# EasyEDA Pro project tumkibot_new.eprj

# Schematic Schematic1
Board Name: Board1; Create Date: 2025-09-24; Page Name: P1; Project Name: tumkibot_new; Schematic Name: Schematic1; Update Date: 2025-09-24; Company: EasyEDA.com; Page Size: A4; Version: V1.0
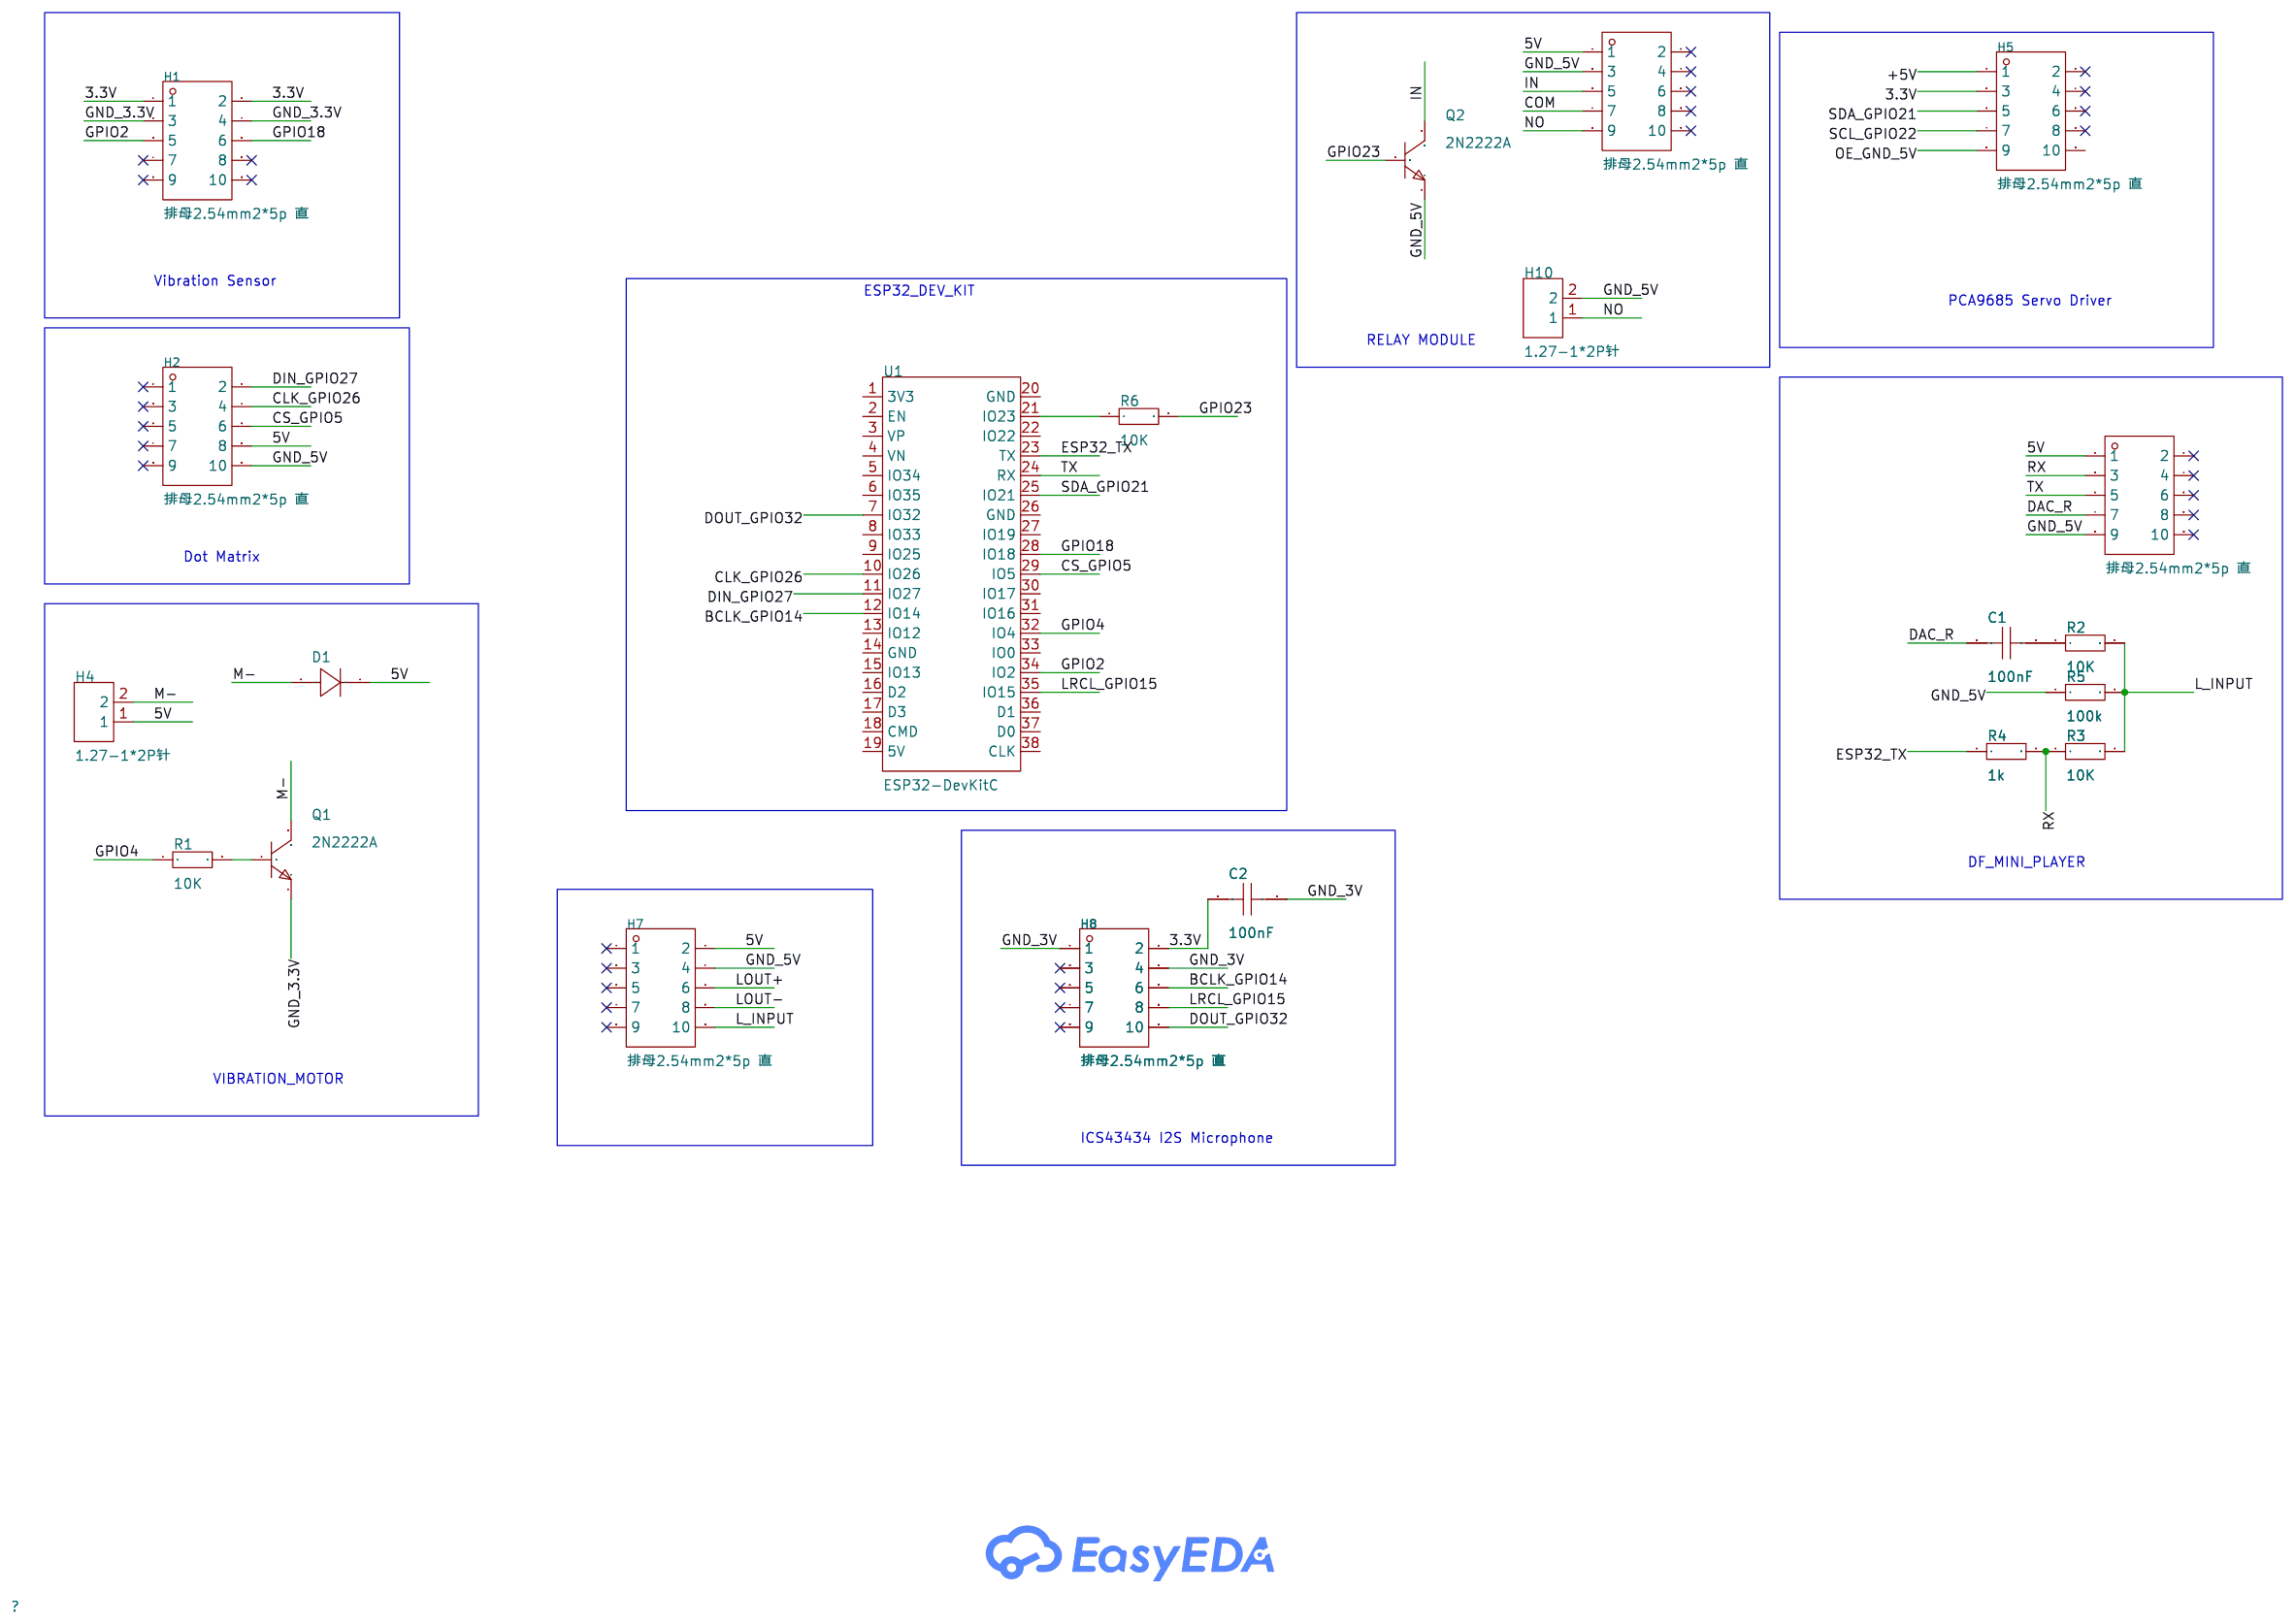
[diagram p0: schematic sheet]

## Parts
C1  100nF  [C0603]
C2  100nF  [C0603]
D1  -  [SMA_L4.4-W2.8-LS5.4-RD]
H1  排母2.54mm2*5p 直  [HDR-TH_10P-P2.54-V-F-R2-C5-S2.54]
H2  排母2.54mm2*5p 直  [HDR-TH_10P-P2.54-V-F-R2-C5-S2.54]
H4  1.27-1*2P针  [HDR-TH_2P-P1.27-V-M]
H5  排母2.54mm2*5p 直  [HDR-TH_10P-P2.54-V-F-R2-C5-S2.54]
H6  排母2.54mm2*5p 直  [HDR-TH_10P-P2.54-V-F-R2-C5-S2.54]
H7  排母2.54mm2*5p 直  [HDR-TH_10P-P2.54-V-F-R2-C5-S2.54]
H8  排母2.54mm2*5p 直  [HDR-TH_10P-P2.54-V-F-R2-C5-S2.54]
H9  排母2.54mm2*5p 直  [HDR-TH_10P-P2.54-V-F-R2-C5-S2.54]
H10  1.27-1*2P针  [HDR-TH_2P-P1.27-V-M]
Q1  2N2222A  [TO-92-3_L4.5-W3.5-P1.27-L]
Q2  2N2222A  [TO-92-3_L4.5-W3.5-P1.27-L]
R1  10K  [R0603]
R2  10K  [R0603]
R3  10K  [R0603]
R4  10K  [R0603]
R5  10K  [R0603]
R6  10K  [R0603]
U1  ESP32-DevKitC  [BULETM-SMD_ESP32-DEVKITC]

## Library data of the parts
C1 C2 = CAP_0603: Supplier Footprint: 0603
D1 = 1N4007: Supplier Footprint: SMA(DO-214AC); Supplier Part: C727081
H1 H2 H5-H9 = 排母2.54mm2*5p 直: LCSC Part Name: 间距:2.54mm 直插; Supplier Part: C30419; Manufacturer: BOOMELE(博穆精密); Supplier Footprint: 插件,P=2.54mm; JLCPCB Part Class: Extended Part; Supplier: LCSC; Pitch: 2.54mm; Row Spacing: 2.54mm; Mounting Type: Through Hole; Number of Rows: 2; Number of Positions: 10P; Contact Material: Brass
H4 H10 = 1.27-1*2P针: LCSC Part Name: 1x2P 间距:1.27mm 方针 直插; Supplier Part: C703015; Manufacturer: BOOMELE(博穆精密); Supplier Footprint: 插件,P=1.27mm; JLCPCB Part Class: Extended Part; Datasheet: https://item.szlcsc.com/datasheet/1.27-1*2P%25E9%2592%2588/738187.html; Supplier: LCSC; Pin Structure: 1x2P; Pitch: 1.27mm; Circluar Pins/Square Pins: Pin Header; Mounting Type: Through Hole; Number of Rows: 1; Number of Pins: 2P; Current Rating: 3A; Length of Mating Pin: 3mm; Insulation Height: 1.7mm; Length of End Connection Pin: 2.5mm; Contact Material: Brass; Operating Temperature: -55℃~+105℃; Color: Black
Q1 Q2 = 2N2222A_C20616319: Supplier Part: C20616319; Manufacturer: HXY MOSFET(华轩阳电子); Supplier Footprint: TO-92; JLCPCB Part Class: Extended Part; Datasheet: https://item.szlcsc.com/datasheet/2N2222A/21982678.html; Supplier: LCSC; type: NPN; Current - Collector(Ic): 600mA; Collector - Emitter Voltage VCEO: 40V; Pd - Power Dissipation: 625mW; DC Current Gain: 300@150mA,10V; Transition frequency(fT): 300MHz; Current - Collector Cutoff: 10nA; Vce Saturation(VCE(sat)): 600mV@500mA,50mA; Operating Temperature: -55℃~+150℃; Emitter-Base Voltage(Vebo): 6V; Number: 1 NPN
R1-R6 = Res_0603: Supplier Footprint: 0603
U1 = ESP32-DevKitC: LCSC Part Name: 开发板; Supplier Part: C571180; Manufacturer: ESPRESSIF(乐鑫); JLCPCB Part Class: Extended Part; Datasheet: https://atta.szlcsc.com/upload/public/pdf/source/20200521/C529586_D6FCDAFCFF160B3EDDF7DF28D600699D.pdf; Supplier: LCSC

## Nets
3.3V: C2.2 H1.1 H1.2 H5.3 H8.2
5V: D1.1(K) H2.8 H4.1 H6.1 H7.2 H9.1
+5V: H5.1
GND_3.3V: H1.3 H1.4 Q1.1(E)
GND_3V: C2.1 H8.1 H8.4
GND_5V: H2.10 H6.9 H7.4 H9.3 H10.2 Q2.1(E) R5.1
BCLK_GPIO14: H8.6 U1.12(IO14)
CLK_GPIO26: H2.4 U1.10(IO26)
COM: H9.7
CS_GPIO5: H2.6 U1.29(IO5)
DAC_R: C1.2 H6.7
DIN_GPIO27: H2.2 U1.11(IO27)
DOUT_GPIO32: H8.10 U1.7(IO32)
ESP32_TX: R4.1 U1.23(TX)
GPIO2: H1.5 U1.34(IO2)
GPIO4: R1.1 U1.32(IO4)
GPIO18: H1.6 U1.28(IO18)
GPIO23: Q2.2(B) R6.2
IN: H9.5 Q2.3(C)
L_INPUT: H7.10 R2.2 R3.2 R5.2
LOUT+: H7.6
LOUT-: H7.8
LRCL_GPIO15: H8.8 U1.35(IO15)
M-: D1.2(A) H4.2 Q1.3(C)
NO: H9.9 H10.1
OE_GND_5V: H5.9
RX: H6.3 R3.1 R4.2
SCL_GPIO22: H5.7
SDA_GPIO21: H5.5 U1.25(IO21)
TX: H6.5 U1.24(RX)
$1N2269: Q1.2(B) R1.2
$1N3379: C1.1 R2.1
$1N4010: R6.1 U1.21(IO23)

Not connected (* = marked no-connect by the designer): H1 7* 8* 9* 10*; H2 1* 3* 5* 7* 9*; H5 2* 4* 6* 8* 10; H6 2* 4* 6* 8* 10*; H7 1* 3* 5* 7* 9*; H8 3* 5* 7* 9*; H9 2* 4* 6* 8* 10*; U1 1(3V3) 2(EN) 3(VP) 4(VN) 5(IO34) 6(IO35) 8(IO33) 9(IO25) 13(IO12) 14(GND) 15(IO13) 16(D2) 17(D3) 18(CMD) 19(5V) 20(GND) 22(IO22) 26(GND) 27(IO19) 30(IO17) 31(IO16) 33(IO0) 36(D1) 37(D0) 38(CLK)

## Notes on the sheet
- Vibration Sensor
- ESP32_DEV_KIT
- PCA9685 Servo Driver
- RELAY MODULE
- Dot Matrix
- DF_MINI_PLAYER
- VIBRATION_MOTOR
- ICS43434 I2S Microphone

# Board PCB1
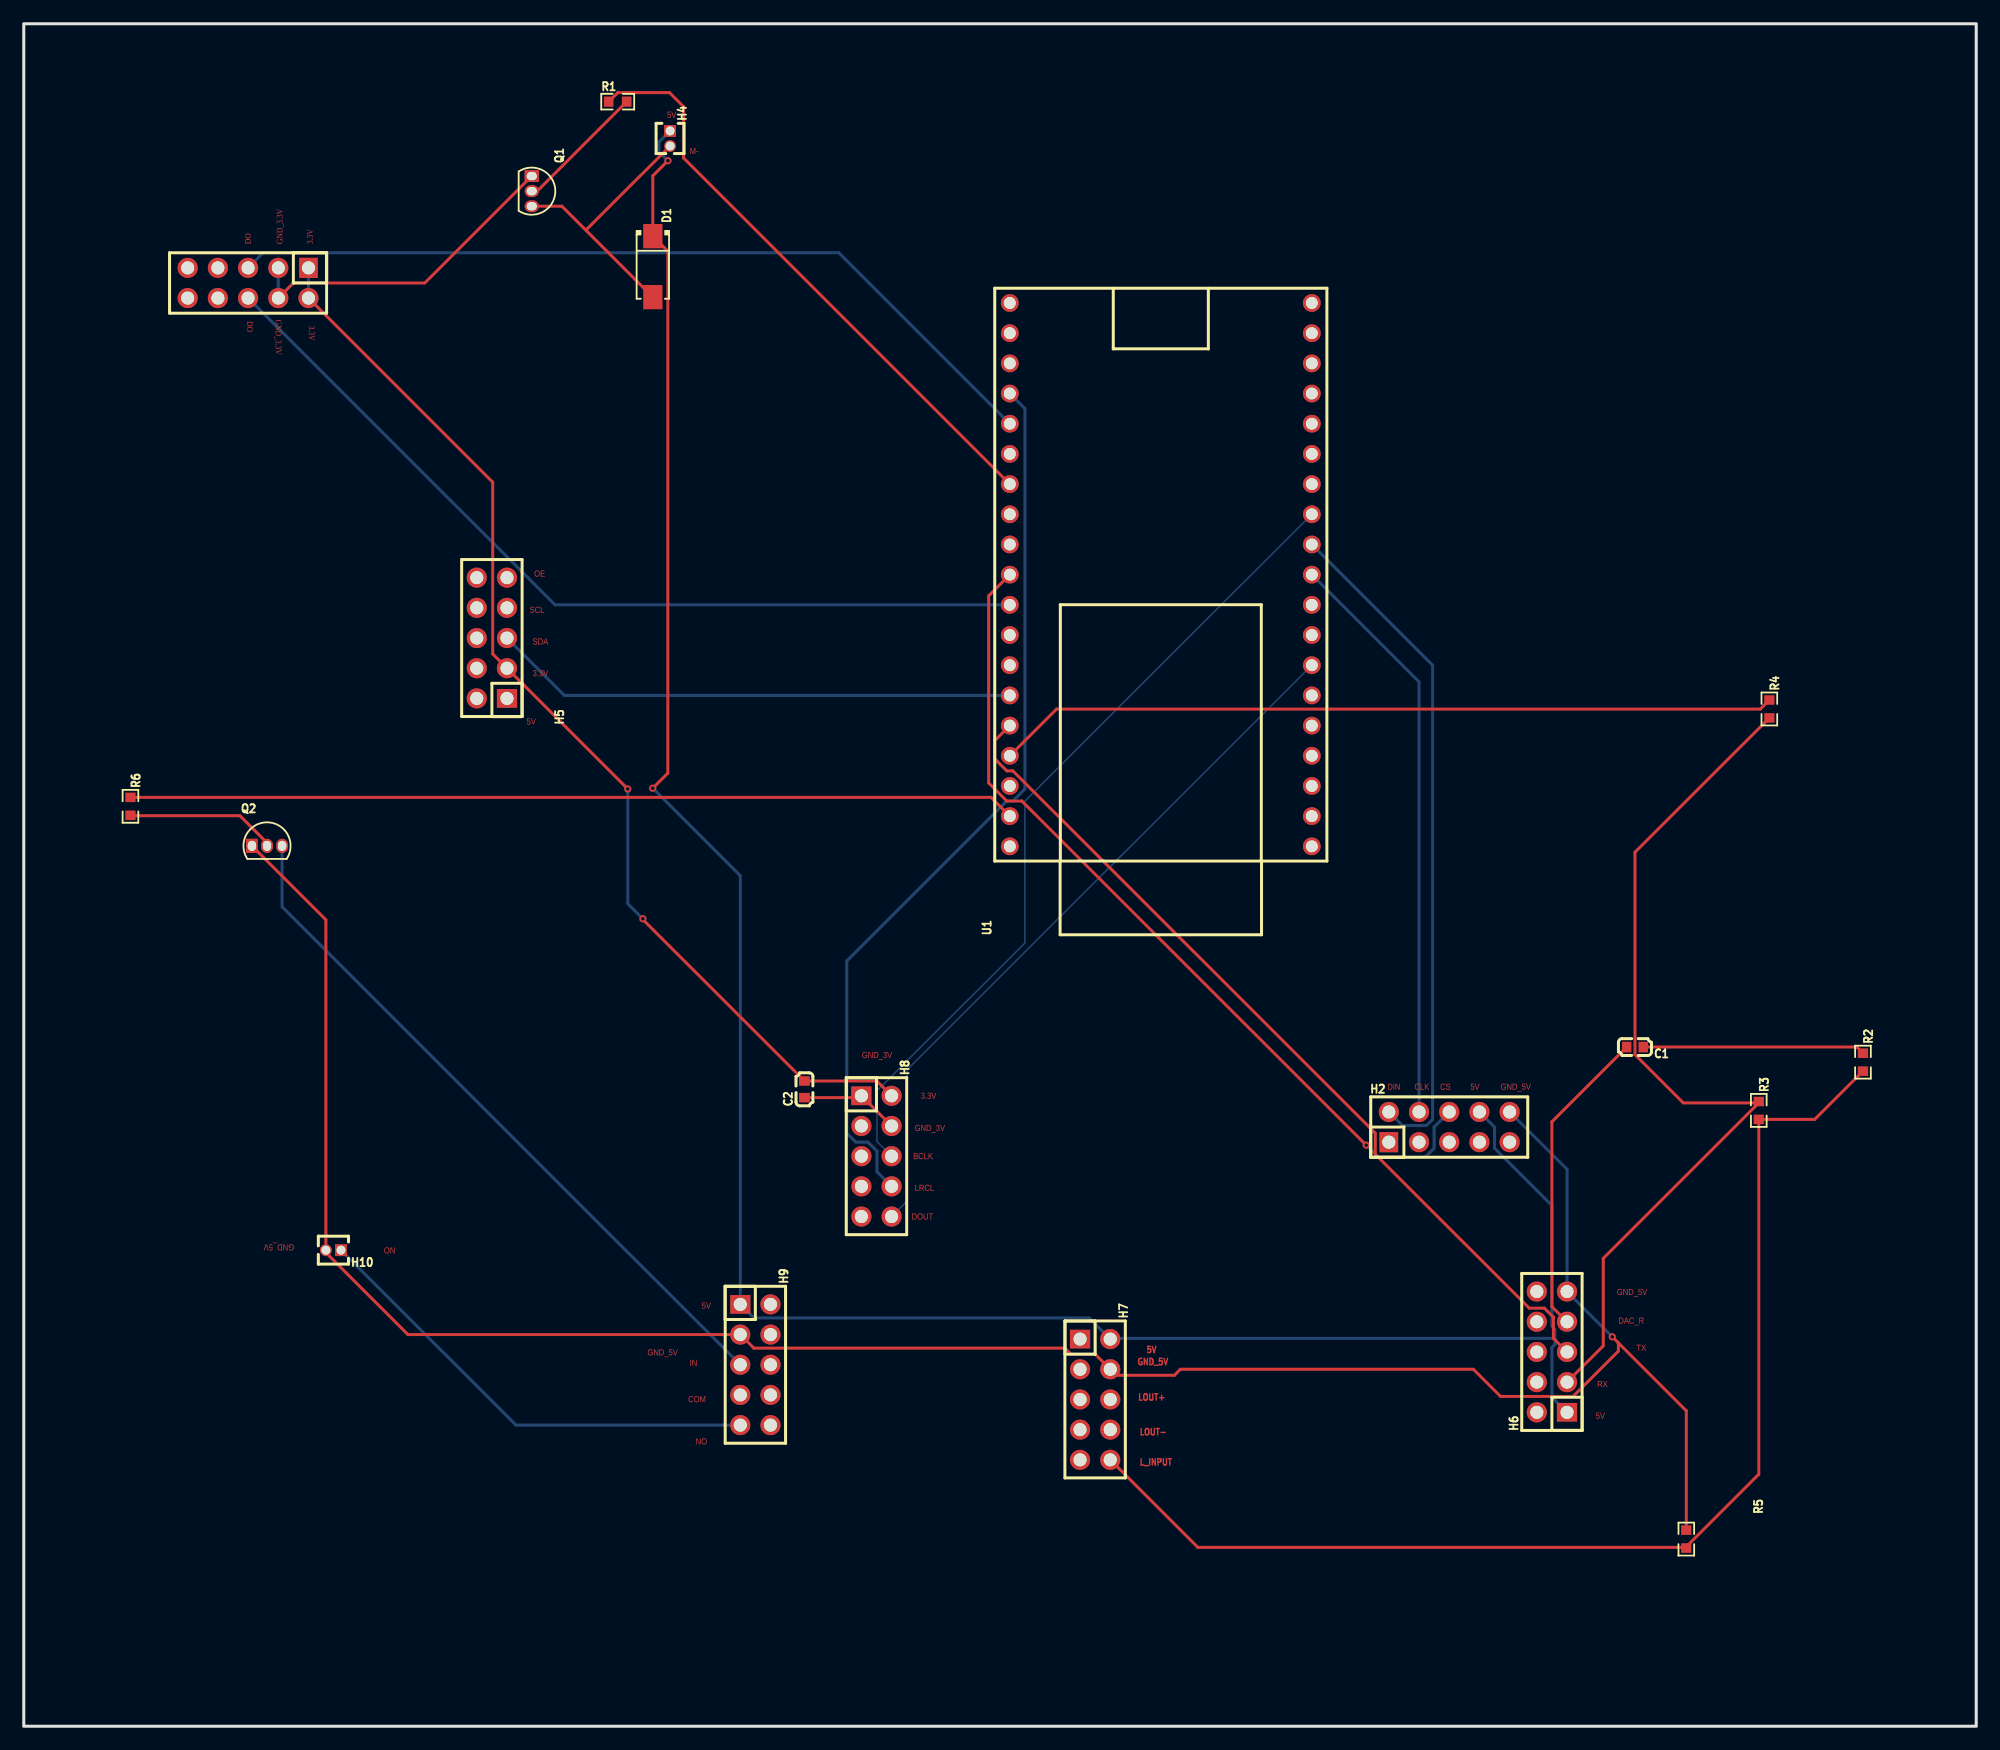
[diagram p1: board, top side]
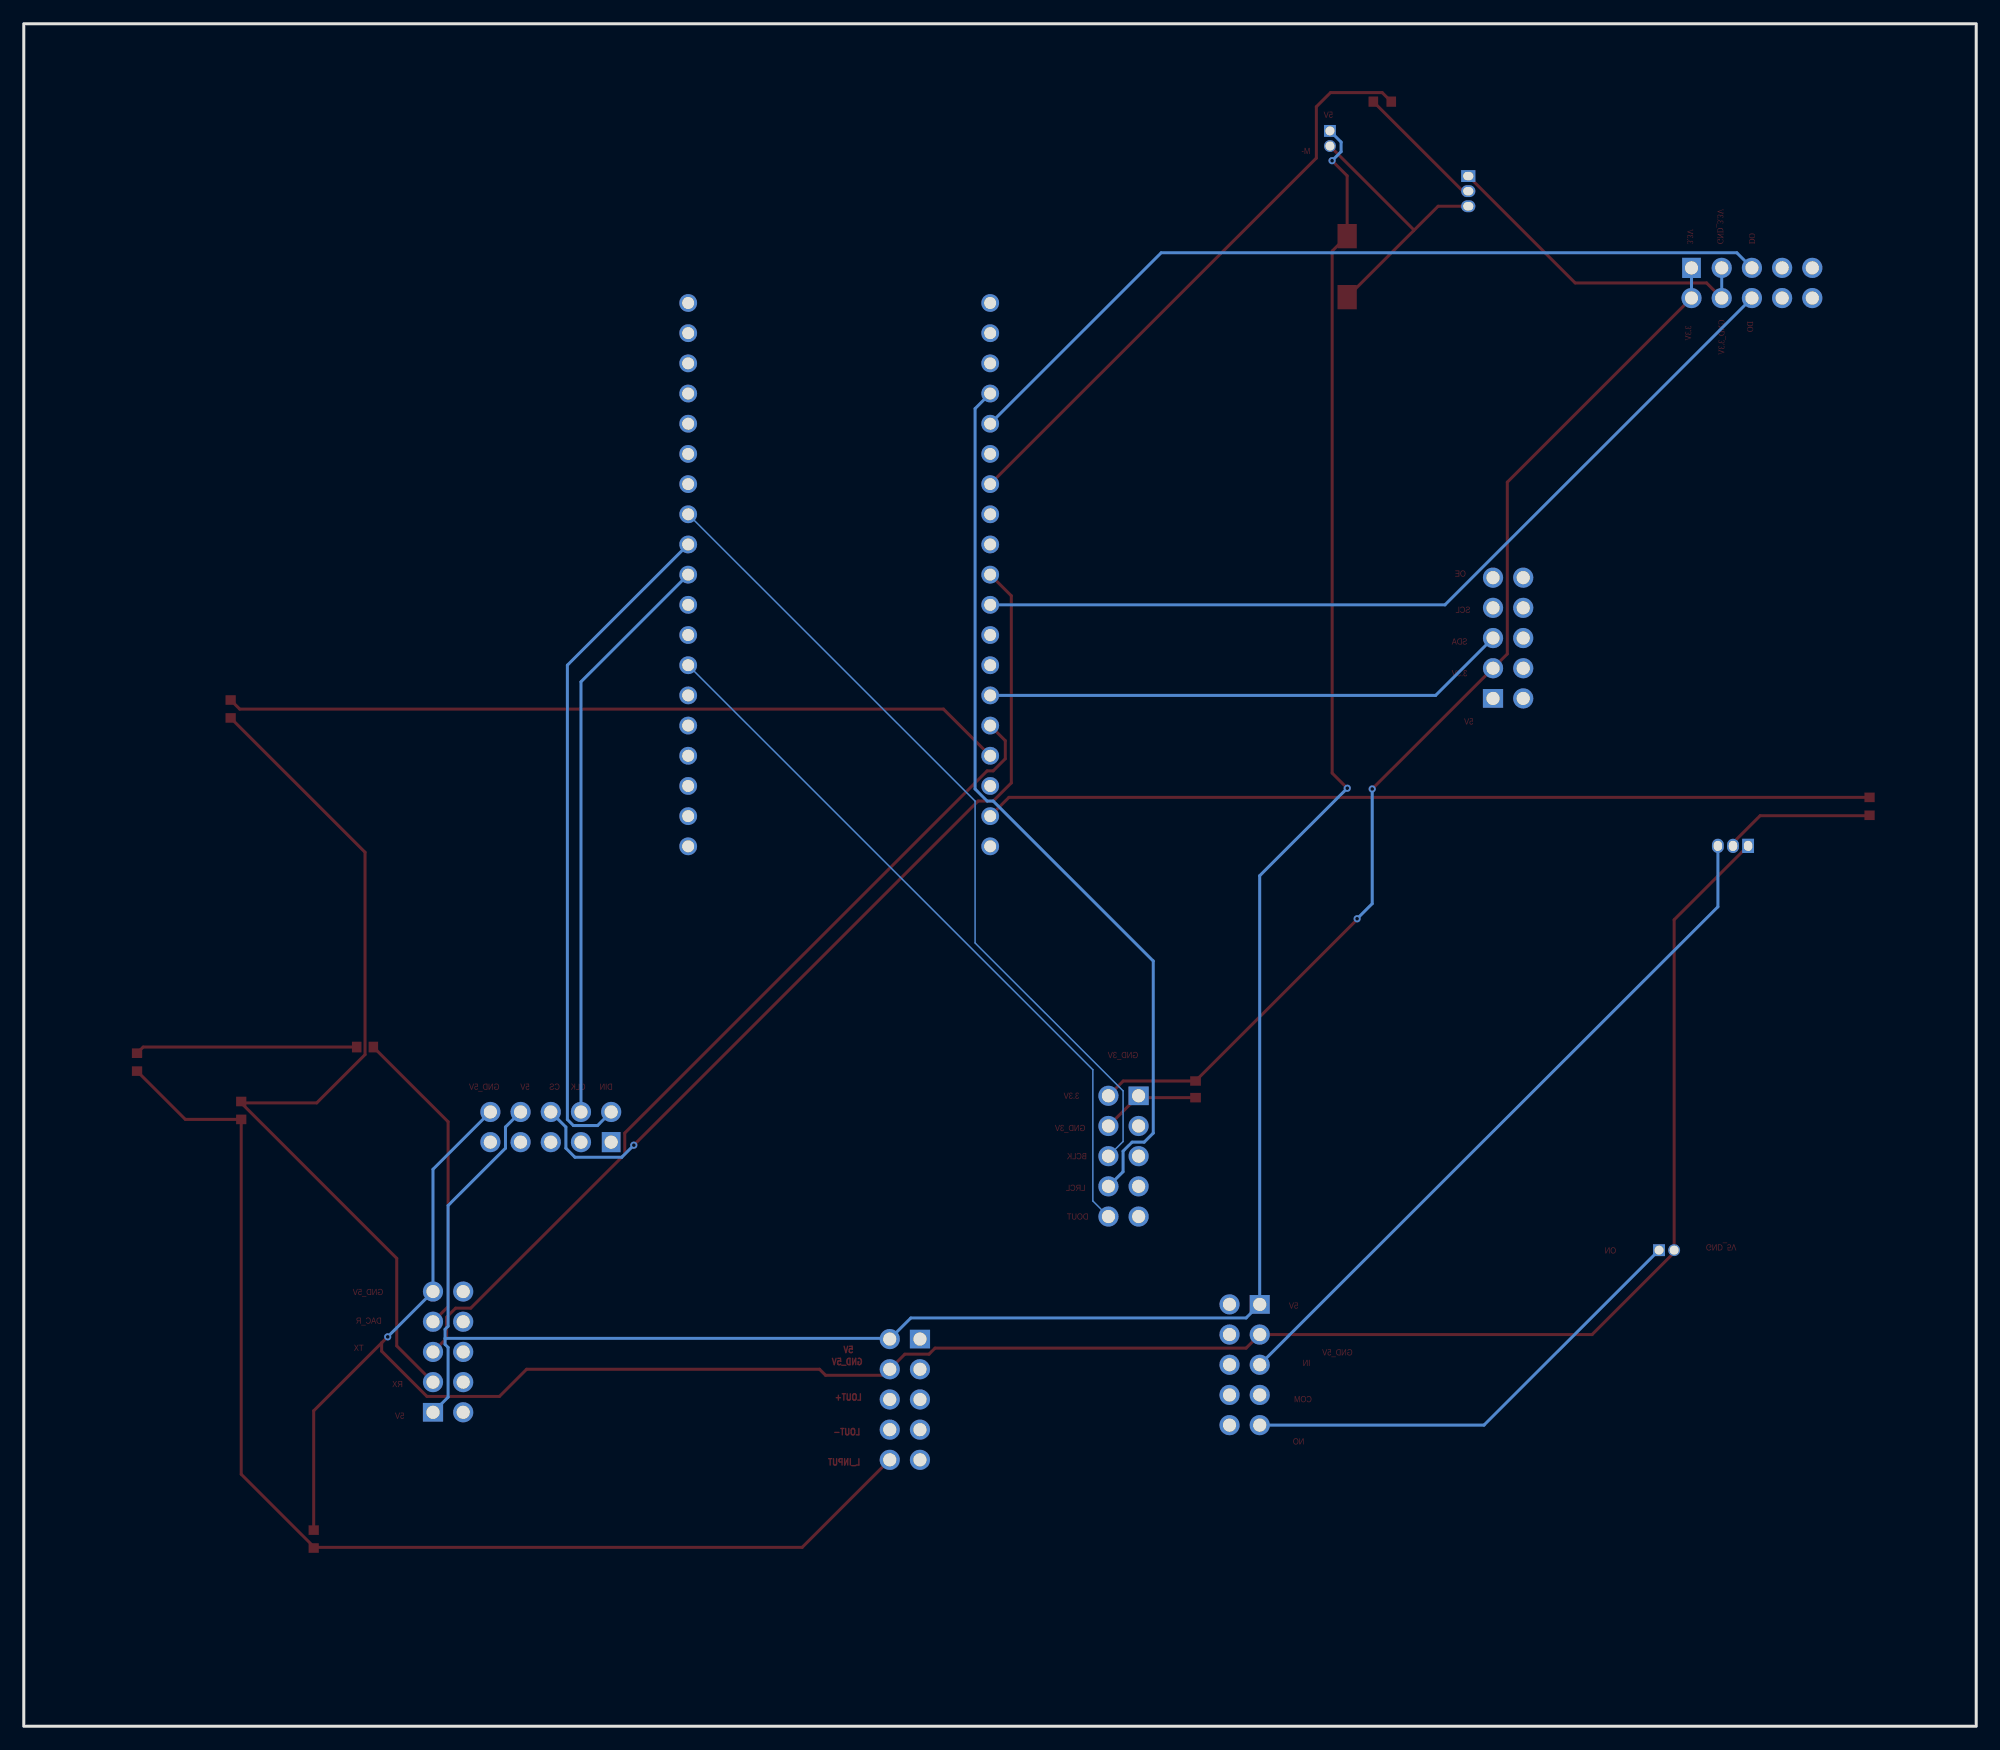
[diagram p2: board, bottom side, seen from below]

Outline 164.21 x 143.26 mm; copper layers: Top Layer, Bottom Layer. Coordinates in mm from the lower left corner of the outline.
Outline path: rectangle 0,143.26 164.21,0
Stack: Top Layer 0.035mm / Dielectric1 1.51mm FR4 er 4.5 / Bottom Layer 0.035mm

## Design rules (mm)
template: JLCPCB Capability(Two Layers Board)
spacing copperThickness1oz (default): track to track 0.102, other pairs 0.152 to 0.3
spacing copperThickness2oz: track to track 0.203, other pairs 0.152 to 0.3
track width copperThickness1oz (default): min 0.127, default 0.254, max 2.54
track width copperThickness2oz: min 0.203, default 0.254, max 2.54
differential pair differentialPair (default): width min 0.127, default 0.254, max 2.54; gap min 0.152, default 0.152
via viaSize (default): diameter min 0.5, default 0.61, max 10; hole min 0.3, default 0.305, max 6.3

## Placement (name value [footprint] x y rotation side)
C1  100nF  [C0603]  135.51 57.15 180 top
C2  100nF  [C0603]  65.66 53.59 90 top
D1  -  [SMA_L4.4-W2.8-LS5.4-RD]  52.91 122.82 270 top
H1  排母2.54mm2*5p 直  [HDR-TH_10P-P2.54-V-F-R2-C5-S2.54]  18.87 121.44 180 top
H2  排母2.54mm2*5p 直  [HDR-TH_10P-P2.54-V-F-R2-C5-S2.54]  119.89 50.42 0 top
H4  1.27-1*2P针  [HDR-TH_2P-P1.27-V-M]  54.36 133.6 270 top
H5  排母2.54mm2*5p 直  [HDR-TH_10P-P2.54-V-F-R2-C5-S2.54]  39.37 91.57 90 top
H6  排母2.54mm2*5p 直  [HDR-TH_10P-P2.54-V-F-R2-C5-S2.54]  128.52 31.5 90 top
H7  排母2.54mm2*5p 直  [HDR-TH_10P-P2.54-V-F-R2-C5-S2.54]  90.11 27.5 270 top
H8  排母2.54mm2*5p 直  [HDR-TH_10P-P2.54-V-F-R2-C5-S2.54]  71.72 47.97 270 top
H9  排母2.54mm2*5p 直  [HDR-TH_10P-P2.54-V-F-R2-C5-S2.54]  61.53 30.42 270 top
H10  1.27-1*2P针  [HDR-TH_2P-P1.27-V-M]  26.04 40.06 180 top
Q1  2N2222A  [TO-92-3_L4.5-W3.5-P1.27-L]  42.72 129.17 270 top
Q2  2N2222A  [TO-92-3_L4.5-W3.5-P1.27-L]  20.46 74.08 0 top
R1  10K  [R0603]  49.95 136.7 0 top
R2  10K  [R0603]  154.69 55.88 270 top
R3  10K  [R0603]  145.92 51.82 270 top
R4  10K  [R0603]  146.81 85.6 270 top
R5  10K  [R0603]  139.83 15.75 270 top
R6  10K  [R0603]  8.97 77.41 270 top
U1  ESP32-DevKitC  [BULETM-SMD_ESP32-DEVKITC]  95.63 96.9 90 top

## Footprints (pads in the part's own frame, mm; a bottom-side part is the same pattern mirrored in y, then rotated)
BULETM-SMD_ESP32-DEVKITC
  round 1.5 hole 1: 1(-22.86,-12.7) 2(-20.32,-12.7) 3(-17.78,-12.7) 4(-15.24,-12.7) 5(-12.7,-12.7) 6(-10.16,-12.7) 7(-7.62,-12.7) 8(-5.08,-12.7) 9(-2.54,-12.7) 10(0,-12.7) 11(2.54,-12.7) 12(5.08,-12.7) 13(7.62,-12.7) 14(10.16,-12.7) 15(12.7,-12.7) 16(15.24,-12.7) 17(17.78,-12.7) 18(20.32,-12.7) 19(22.86,-12.7) 20(-22.86,12.7) 21(-20.32,12.7) 22(-17.78,12.7) 23(-15.24,12.7) 24(-12.7,12.7) 25(-10.16,12.7) 26(-7.62,12.7) 27(-5.08,12.7) 28(-2.54,12.7) 29(0,12.7) 30(2.54,12.7) 31(5.08,12.7) 32(7.62,12.7) 33(10.16,12.7) 34(12.7,12.7) 35(15.24,12.7) 36(17.78,12.7) 37(20.32,12.7) 38(22.86,12.7)
C0603
  rect 0.8x0.9 smd: 1(-0.7,0) 2(0.7,0)
HDR-TH_2P-P1.27-V-M
  rect 1x1 hole 0.75: 1(-0.635,0)
  round 1 hole 0.75: 2(0.635,0)
HDR-TH_10P-P2.54-V-F-R2-C5-S2.54
  rect 1.575x1.7 hole 1.1: 1(-5.08,-1.27)
  round 1.7 hole 1.1: 2(-5.08,1.27) 3(-2.54,-1.27) 4(-2.54,1.27) 5(0,-1.27) 6(0,1.27) 7(2.54,-1.27) 8(2.54,1.27) 9(5.08,-1.27) 10(5.08,1.27)
R0603
  rect 0.806x0.864 smd: 1(-0.753,0) 2(0.753,0)
SMA_L4.4-W2.8-LS5.4-RD
  rect 2.046x1.62 smd: 1(-2.566,0) 2(2.566,0)
TO-92-3_L4.5-W3.5-P1.27-L
  rect 1x1.2 hole 0.7x0.85: 1(-1.27,0)
  oval 1x1.2 hole 0.7x0.85: 2(0,0) 3(1.27,0)

## Nets
As in the schematic.

Pads without a net: H1 7 8 9 10; H2 1 3 5 7 9; H5 2 4 6 8 10; H6 2 4 6 8 10; H7 1 3 5 7 9; H8 3 5 7 9; H9 2 4 6 8 10; U1 1 2 3 4 5 6 8 9 13 14 15 16 17 18 19 20 22 26 27 30 31 33 36 37 38

## Via types
v1: diameter 0.61, hole 0.305, Top Layer to Bottom Layer, 6 vias

## Routing (per net, layer and track width the routed paths; a pad name or vN(x,y) marks a point on that pad's centre or on a via; arc(x,y) is an arc through that point)
3.3V: length 93.5
  Top Layer w0.254: v1(50.8,78.87) H5.3 39.44,90.23 39.44,104.68 23.95,120.17 ; v1(52.07,67.94) 52.07,67.88 C2.2 71.74,54.29 H8.2
  Bottom Layer w0.254: v1(50.8,78.87) 50.8,69.21 v1(52.07,67.94) ; 23.95,120.17 H1.1
5V: length 202.4
  Top Layer w0.254: v1(54.18,131.73) 52.91,130.46 D1.1 54.17,124.12 54.17,80.2 v1(52.9,78.93)
  Bottom Layer w0.254: 60.26,35.5 61.41,34.35 89.6,34.35 91.38,32.58 91.44,32.64 128.78,32.64 ; 60.26,35.5 60.26,71.56 v1(52.9,78.93) ; 60.26,35.5 H9.1 ; 128.78,32.64 128.78,32.13 128.52,31.88 128.52,27.69 H6.1 ; 128.78,32.64 128.78,33.4 128.52,33.66 128.52,43.81 123.7,48.64 123.7,50.42 H2.8 ; v1(54.18,131.73) 53.42,132.5 53.42,133.3 54.36,134.24
GND_3.3V: length 28.1
  Top Layer w0.254: Q1.1 33.73,121.44 22.68,121.44 21.41,120.17
  Bottom Layer w0.254: 21.41,120.17 H1.3
GND_3V: length 8.4
  Top Layer w0.254: H8.4 H8.1 70.29,52.89 C2.1
GND_5V: length 194.6
  Top Layer w0.254: 134.11,32.26 139.83,26.54 R5.1 ; 134.11,32.26 v1(133.6,32.77) ; 134.11,32.26 134.11,31.56 130.3,27.75 124.21,27.75 121.92,30.04 97.28,30.04 96.77,29.53 91.89,29.53 90.11,31.31 88.08,31.31 87.57,31.81 61.41,31.81 60.26,32.96 32.31,32.96 25.41,39.86 H10.2 25.41,67.86 Q2.1
  Bottom Layer w0.254: v1(133.6,32.77) H6.9 129.79,46.86 H2.10
BCLK_GPIO14: length 69.7
  Bottom Layer w0.127: H8.6 71.75,49.2 71.75,53.47 84.2,65.91 84.2,77.85 U1.12
CLK_GPIO26: length 48.9
  Bottom Layer w0.254: H2.4 117.35,87.88 U1.10
CS_GPIO5: length 72.7
  Top Layer w0.254: v1(112.9,48.89) 83.95,77.85 82.68,77.85 81.15,79.37 81.15,95.12 U1.29
  Bottom Layer w0.254: v1(112.9,48.89) 113.92,47.88 117.86,47.88 118.62,48.64 118.62,50.42 H2.6
DAC_R: length 26.2
  Top Layer w0.254: C1.2 128.52,50.86 128.52,35.31 H6.7
DIN_GPIO27: length 57
  Bottom Layer w0.254: H2.2 115.95,50.55 117.98,50.55 118.49,51.05 118.49,89.28 U1.11
DOUT_GPIO32: length 61
  Bottom Layer w0.127: H8.10 74.29,44.2 74.29,55.24 U1.7
ESP32_TX: length 65.8
  Top Layer w0.254: R4.1 146.05,85.59 86.86,85.59 U1.23
GPIO2: length 70.5
  Bottom Layer w0.254: H1.5 20.14,123.98 68.55,123.98 U1.34
GPIO4: length 50.2
  Top Layer w0.254: U1.32 55.5,131.95 55.5,136.27 54.31,137.46 49.96,137.46 R1.1
GPIO18: length 74.8
  Bottom Layer w0.254: U1.28 44.68,94.36 18.87,120.17
GPIO23: length 12.7
  Top Layer w0.254: R6.2 9,76.62 18.17,76.62 20.46,74.33 Q2.2
IN: length 59.6
  Bottom Layer w0.254: Q2.3 21.73,68.95 H9.5
L_INPUT: length 100.5
  Top Layer w0.254: 139.77,15.05 R5.2 ; 139.77,15.05 98.74,15.05 91.38,22.42 ; 139.77,15.05 145.92,21.2 R3.2 150.62,51.06 R2.2
LRCL_GPIO15: length 75.9
  Bottom Layer w0.254: U1.35 84.2,110.87 84.2,78.87 83.19,77.85 82.68,77.85 69.22,64.39 69.22,49.91 69.98,49.15 70.99,49.15 71.75,48.39 71.75,46.66 H8.8
M-: length 23.4
  Top Layer w0.254: 47.32,125.84 45.26,127.9 Q1.3 ; 47.32,125.84 D1.2 ; 47.32,125.84 47.32,125.93 H4.2
NO: length 39.7
  Bottom Layer w0.254: H10.1 41.4,25.34 H9.9
RX: length 75.4
  Top Layer w0.254: H6.3 132.84,32 132.84,39.37 145.92,52.45 ; R4.2 135.51,73.54 135.51,56.51 139.57,52.45 145.92,52.45 ; 145.92,52.45 R3.1
SDA_GPIO21: length 44.3
  Bottom Layer w0.254: H5.5 45.47,86.74 U1.25
TX: length 74.2
  Top Layer w0.254: U1.24 81.66,82.93 81.66,81.41 82.68,80.39 83.19,80.39 113.66,49.91 113.66,48.13 126.62,35.18 127.89,35.18 128.65,34.42 128.65,32.64 H6.5
$1N2269: length 11.1
  Top Layer w0.254: R1.2 43.17,129.17 Q1.2
$1N3379: length 18.7
  Top Layer w0.254: C1.1 154.17,57.15 R2.1
$1N4010: length 74.6
  Top Layer w0.254: R6.1 81.35,78.16 U1.21

## Text on the board
Top Layer: GND_5V | LOUT+ | LOUT- | L_INPUT | 5V | SCL | SDA | 3.3V | OE | COM | M- | IN | NO | GND_3V | DOUT | BCLK | LRCL | DIN | CLK | CS | RX | DAC_R | TX | DO | GND_3.3V
